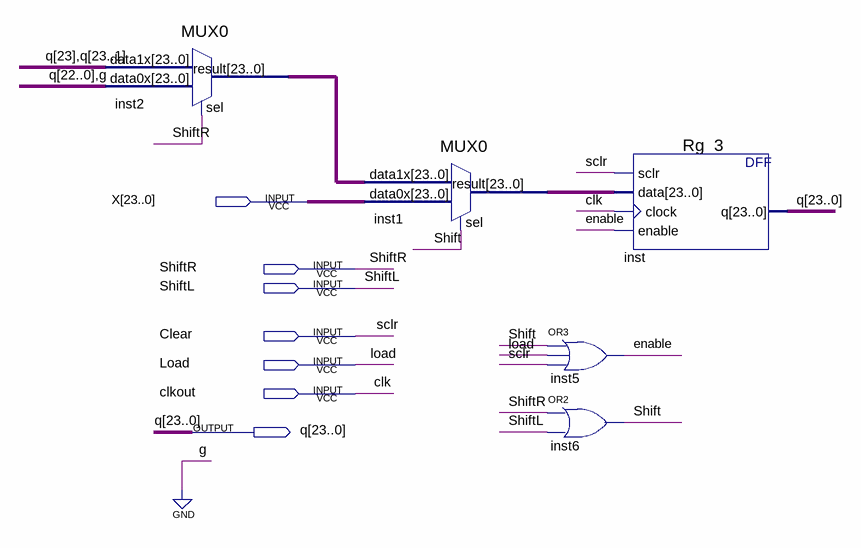
[diagram p0: schematic sheet]
// Quartus schematic Rg3.bdf as structural Verilog: 5 symbols, 7 pins
module Rg3 (
  input  [23:0] X,
  input  ShiftR,
  input  ShiftL,
  input  Clear,
  input  Load,
  input  clkout,
  output [23:0] q
);

  wire enable, Shift;
  wire [23:0] inst1_result, inst2_result;

  MUX0 inst2 (.data1x({{2{q[23]}}, q[22:1]}), .data0x({q[22:0], 1'b0}), .sel(ShiftR), .result(inst2_result));
  MUX0 inst1 (.data1x(inst2_result), .data0x(X), .sel(Shift), .result(inst1_result));
  or inst5 (enable, Shift, Load, Clear);
  or inst6 (Shift, ShiftR, ShiftL);
  Rg_3 inst (.sclr(Clear), .data(inst1_result), .clock(clkout), .enable(enable), .q(q));

  // Other names for the same wires on the sheet: clk = clkout; sclr = Clear
endmodule
